# Altium schematic sheet sd_slot.SchDoc
size A4; SheetNumber: 3; SheetTotal: 4
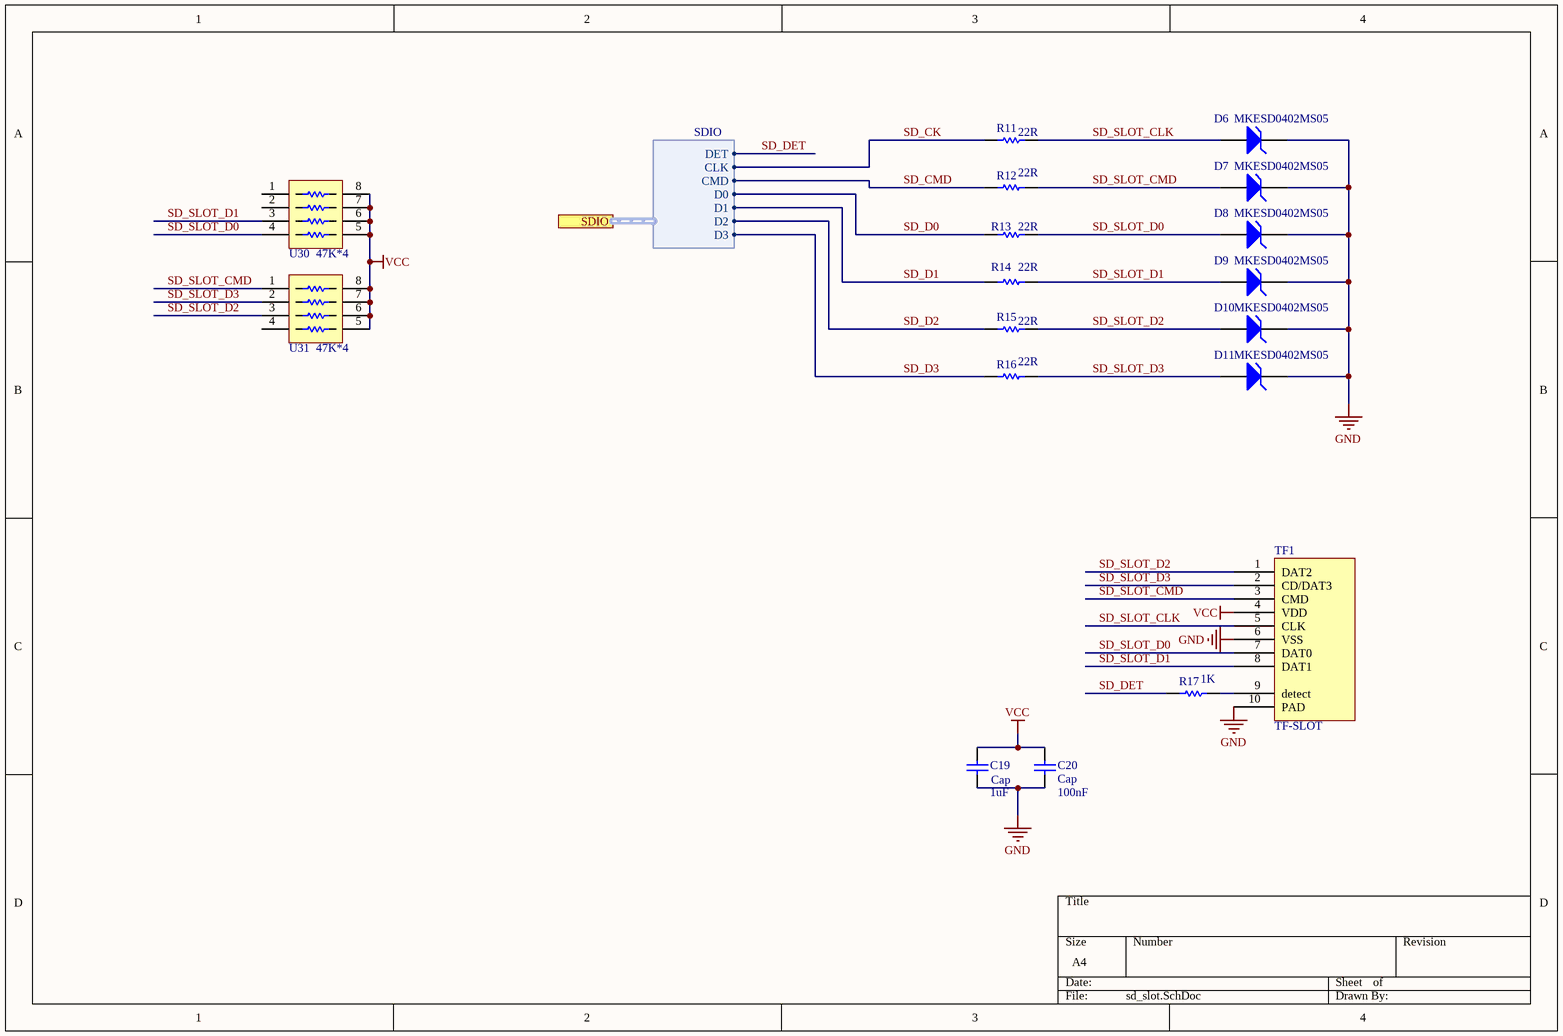
[diagram p0: sd_slot.SchDoc]

## Parts
C19  Cap  value 1uF  [6-0805_L]
C20  Cap  value 100nF  [0402]
D6  MKESD0402MS05  [0402]
D7  MKESD0402MS05  [0402]
D8  MKESD0402MS05  [0402]
D9  MKESD0402MS05  [0402]
D10  MKESD0402MS05  [0402]
D11  MKESD0402MS05  [0402]
R11  value 22R  [0402]  (hidden comment: Res1)
R12  value 22R  [0402]  (hidden comment: Res1)
R13  value 22R  [0402]  (hidden comment: Res1)
R14  value 22R  [0402]  (hidden comment: Res1)
R15  value 22R  [0402]  (hidden comment: Res1)
R16  value 22R  [0402]  (hidden comment: Res1)
R17  value 1K  [0402]  (hidden comment: Res1)
TF1  TF-SLOT  [Micro SD]
U30  47K*4  [0603_RES_BATCH]
U31  47K*4  [0603_RES_BATCH]

## Ports
SDIO (harness SDIO)

## Harnesses
SDIO: CLK, CMD, D0, D1, D2, D3, DET

## Nets
GND: C19.1 C20.1 D6.2(K) D7.2(K) D8.2(K) D9.2(K) D10.2(K) D11.2(K) TF1.6(VSS) TF1.10(PAD)
VCC: C19.2 C20.2 TF1.4(VDD) U30.5 U30.6 U30.7 U30.8 U31.5 U31.6 U31.7 U31.8
SD_CK: R11.2 ; port SDIO.CLK
SD_CMD: R12.2 ; port SDIO.CMD
SD_D0: R13.2 ; port SDIO.D0
SD_D1: R14.2 ; port SDIO.D1
SD_D2: R15.2 ; port SDIO.D2
SD_D3: R16.2 ; port SDIO.D3
SD_DET: R17.2 ; port SDIO.DET
SD_SLOT_CLK: D6.1(A) R11.1 TF1.5(CLK)
SD_SLOT_CMD: D7.1(A) R12.1 TF1.3(CMD) U31.1
SD_SLOT_D0: D8.1(A) R13.1 TF1.7(DAT0) U30.4
SD_SLOT_D1: D9.1(A) R14.1 TF1.8(DAT1) U30.3
SD_SLOT_D2: D10.1(A) R15.1 TF1.1(DAT2) U31.3
SD_SLOT_D3: D11.1(A) R16.1 TF1.2(CD/DAT3) U31.2
NetR17_1: R17.1 TF1.9(detect)

Not connected (* = marked no-connect by the designer): U30 1 2; U31 4

## Library data of the parts
C19 C20 = Cap: Capacitor; Published: 8-Jun-2000; LatestRevisionDate: 17-Jul-2002; LatestRevisionNote: Re-released for DXP Platform.; PackageReference: RAD-0.3; Publisher: Altium Limited; PackageDescription: Radial Cap, Thru-Hole; 2 Leads; 0.3 in Pin Spacing
D6-D11 = D Zener: Zener Diode; Published: 8-Jun-2000; LatestRevisionDate: 17-Jul-2002; LatestRevisionNote: Re-released for DXP Platform.; PackageReference: DIODE-0.7; Publisher: Altium Limited; PackageDescription: Diode, Thru-Hole; 2 Leads; 0.7 in Pin Spacing
R11-R17 = Res1: Resistor; Published: 8-Jun-2000; LatestRevisionDate: 17-Jul-2002; LatestRevisionNote: Re-released for DXP Platform.; PackageReference: AXIAL-0.3; Publisher: Altium Limited; PackageDescription: Axial Device, Thru-Hole; 2 Leads; 0.3 in Pin Spacing
U30 U31 = RES_BATCH